# EAGLE design Test 1 (EAGLE 7.2.0)
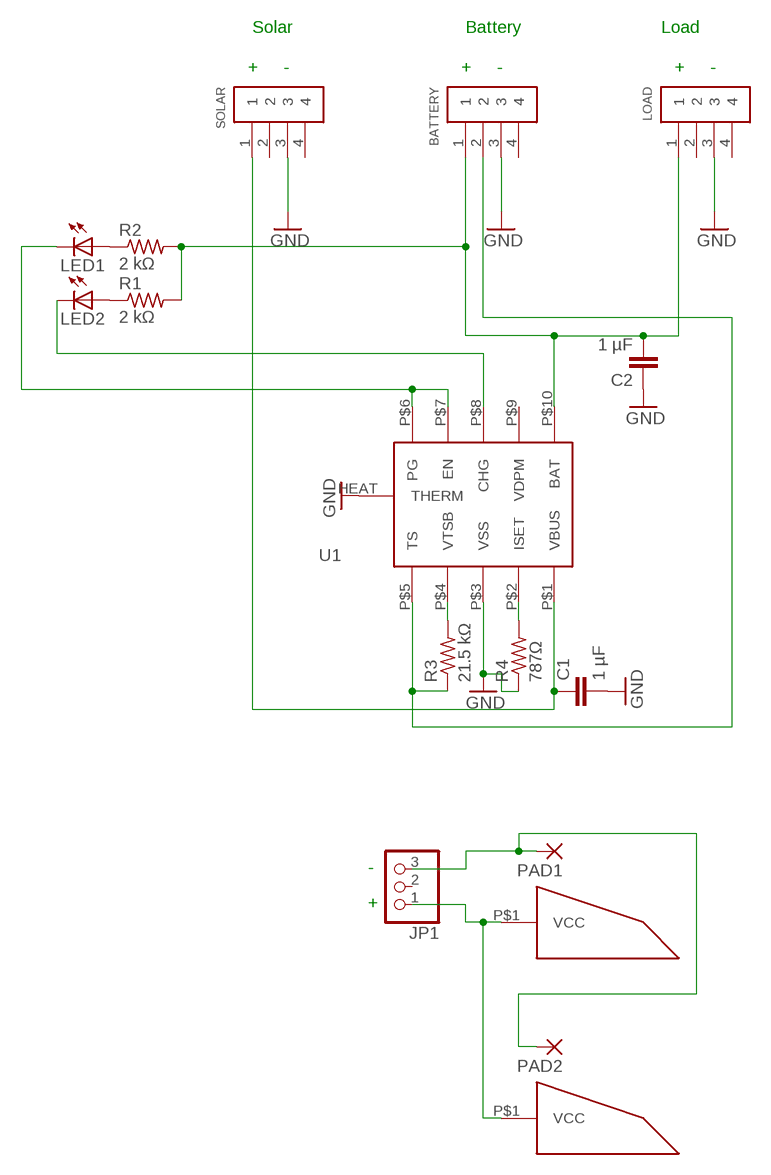
[diagram p0: schematic, sheet 1]

## Parts
BATTERY  1X4-CLEANBIG  [1X04-CLEANBIG]
C1  1 µF  C-EUC0805  [C0805]
C2  1 µF  C-EUC0805  [C0805]
JP1  PINHD-1X3  [1X03]
LED1  LEDCHIP-LED0805  [CHIP-LED0805]
LED2  LEDCHIP-LED0805  [CHIP-LED0805]
LOAD  1X4-CLEANBIG  [1X04-CLEANBIG]
PAD1  SMD2  [SMD1,27-2,54]
PAD2  SMD2  [SMD1,27-2,54]
R1  2 kΩ  R-US_R0805  [R0805]
R2  2 kΩ  R-US_R0805  [R0805]
R3  21.5 kΩ  R-US_R0805  [R0805]
R4  787Ω  R-US_R0805  [R0805]
SOLAR  1X4-CLEANBIG  [1X04-CLEANBIG]
U1  BQ24210  [BQ24210]
U$1  TRISOLX  [TRISOLX]
U$2  TRISOLX  [TRISOLX]

## Nets
GND: BATTERY.3 C1.2 C2.1 LOAD.3 R4.1 SOLAR.3 U1.HEAT(THERM) U1.P$3(VSS)
N$1: LED1.C U1.P$6(PG) U1.P$7(EN)
N$2: BATTERY.2 R3.1 U1.P$5(TS)
N$3: BATTERY.1 C2.2 LOAD.1 R1.2 R2.2 U1.P$10(BAT)
N$4: C1.1 SOLAR.1 U1.P$1(VBUS)
N$5: LED1.A R2.1
N$6: LED2.A R1.1
N$7: R3.2 U1.P$4(VTSB)
N$8: R4.2 U1.P$2(ISET)
N$9: LED2.C U1.P$8(CHG)
N$10: JP1.3 PAD1.1(P) PAD2.1(P)
N$11: JP1.1 U$1.P$1(VCC) U$2.P$1(VCC)
Unconnected: BATTERY.4 JP1.2 LOAD.2 LOAD.4 SOLAR.2 SOLAR.4 U1.P$9(VDPM)

## Notes on the sheet
- Solar | Battery | Load
- + | - | + | - | + | -
- -
- +

## Library data of the parts
BATTERY LOAD SOLAR = adafruit:1X4: 4-pin connector
C1 C2 = rcl:C-EU: CAPACITOR, European symbol
JP1 = adafruit:PINHD-1X3: PIN HEADER
LED1 LED2 = adafruit:LED: LED OSRAM: - CHIPLED LG R971, LG N971, LY N971, LG Q971, LY Q971, LO R971, LY R971 LH N974, LH R974 LS Q976, LO Q976, LY Q976 LO Q996 - Hyper CHIPLED LW Q18S LB Q993, LB Q99A, LB R99A - SideLED LS A670, LO A670, LY A670, LG A670, LP A670 LB A673, LV A673, LT A673, LW A673 LH A674 LY A675 LS A676, LA A676, LO A676, LY A676, LW A676 LS A679, LY A679, LG A679 - Hyper Micro SIDELED® LS Y876, LA Y876, LO Y876, LY Y876 LT Y87S - SmartLED LW L88C, LW L88S LB L89C, LB L89S, LG L890 LS L89K, LO L89K, LY L89K LS L896, LA L896, LO L896, LY L896 - TOPLED LS T670, LO T670, LY T670, LG T670, LP T670 LSG T670, LSP T670, LSY T670, LOP T670, LYG T670 LG T671, LOG T671, LSG T671 LB T673, LV T673, LT T673, LW T673 LH T674 LS T676, LA T676, LO T676, LY T676, LB T676, LH T676, LSB T676, LW T676 LB T67C, LV T67C, LT T67C, LS T67K, LO T67K, LY T67K, LW E67C LS E67B, LA E67B, LO E67B, LY E67B, LB E67C, LV E67C, LT E67C LW T67C LS T679, LY T679, LG T679 LS T770, LO T770, LY T770, LG T770, LP T770 LB T773, LV T773, LT T773, LW T773 LH T774 LS E675, LA E675, LY E675, LS T675 LS T776, LA T776, LO T776, LY T776, LB T776 LHGB T686 LT T68C, LB T68C - Hyper Mini TOPLED® LB M676 - Mini TOPLED Santana® LG M470 LS M47K, LO M47K, LY M47K Source: http://www.osram.convergy.de/
PAD1 PAD2 = wirepad:SMD2: SMD PAD
R1-R4 = adafruit:R-US_: RESISTOR, American symbol
U1 = satellite:BQ24210: Texas Instruments Solar Li-Ion Battery Charger Input Voltage: 3.5V - 18V Output Voltage: 4.2V @ 800mAh
U$1 U$2 = trisolx:TRISOLX

## Board
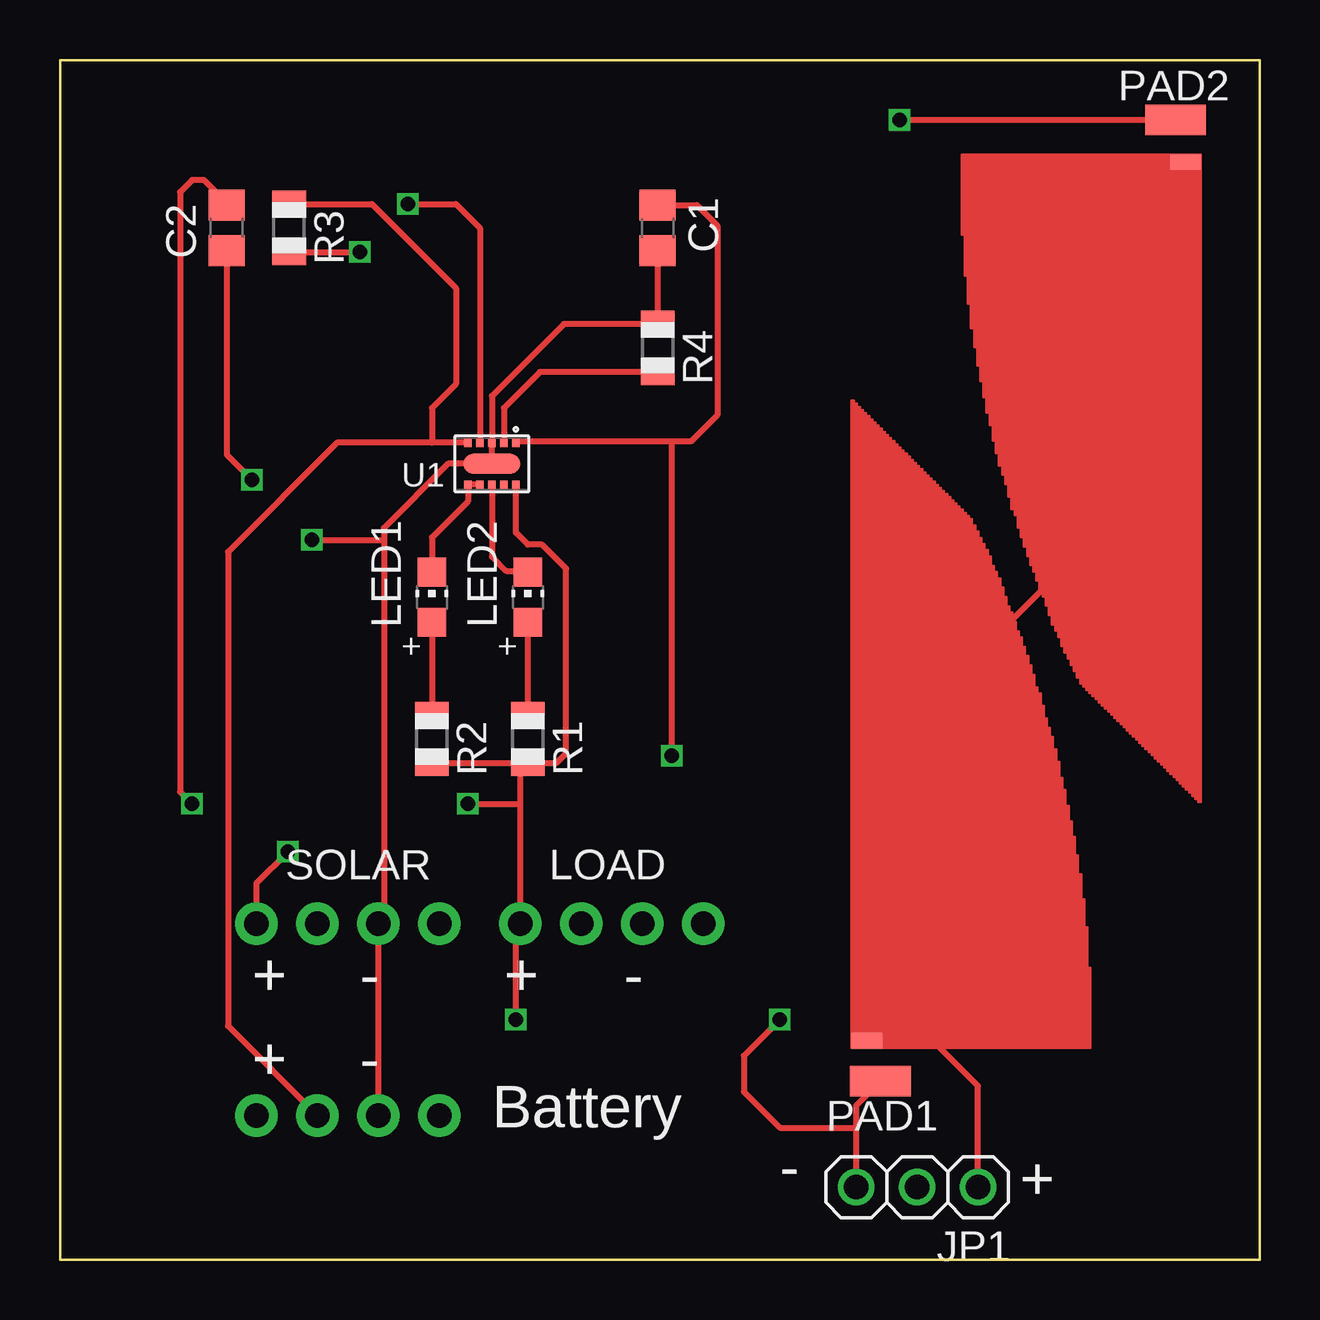
[diagram p1: board, top side]
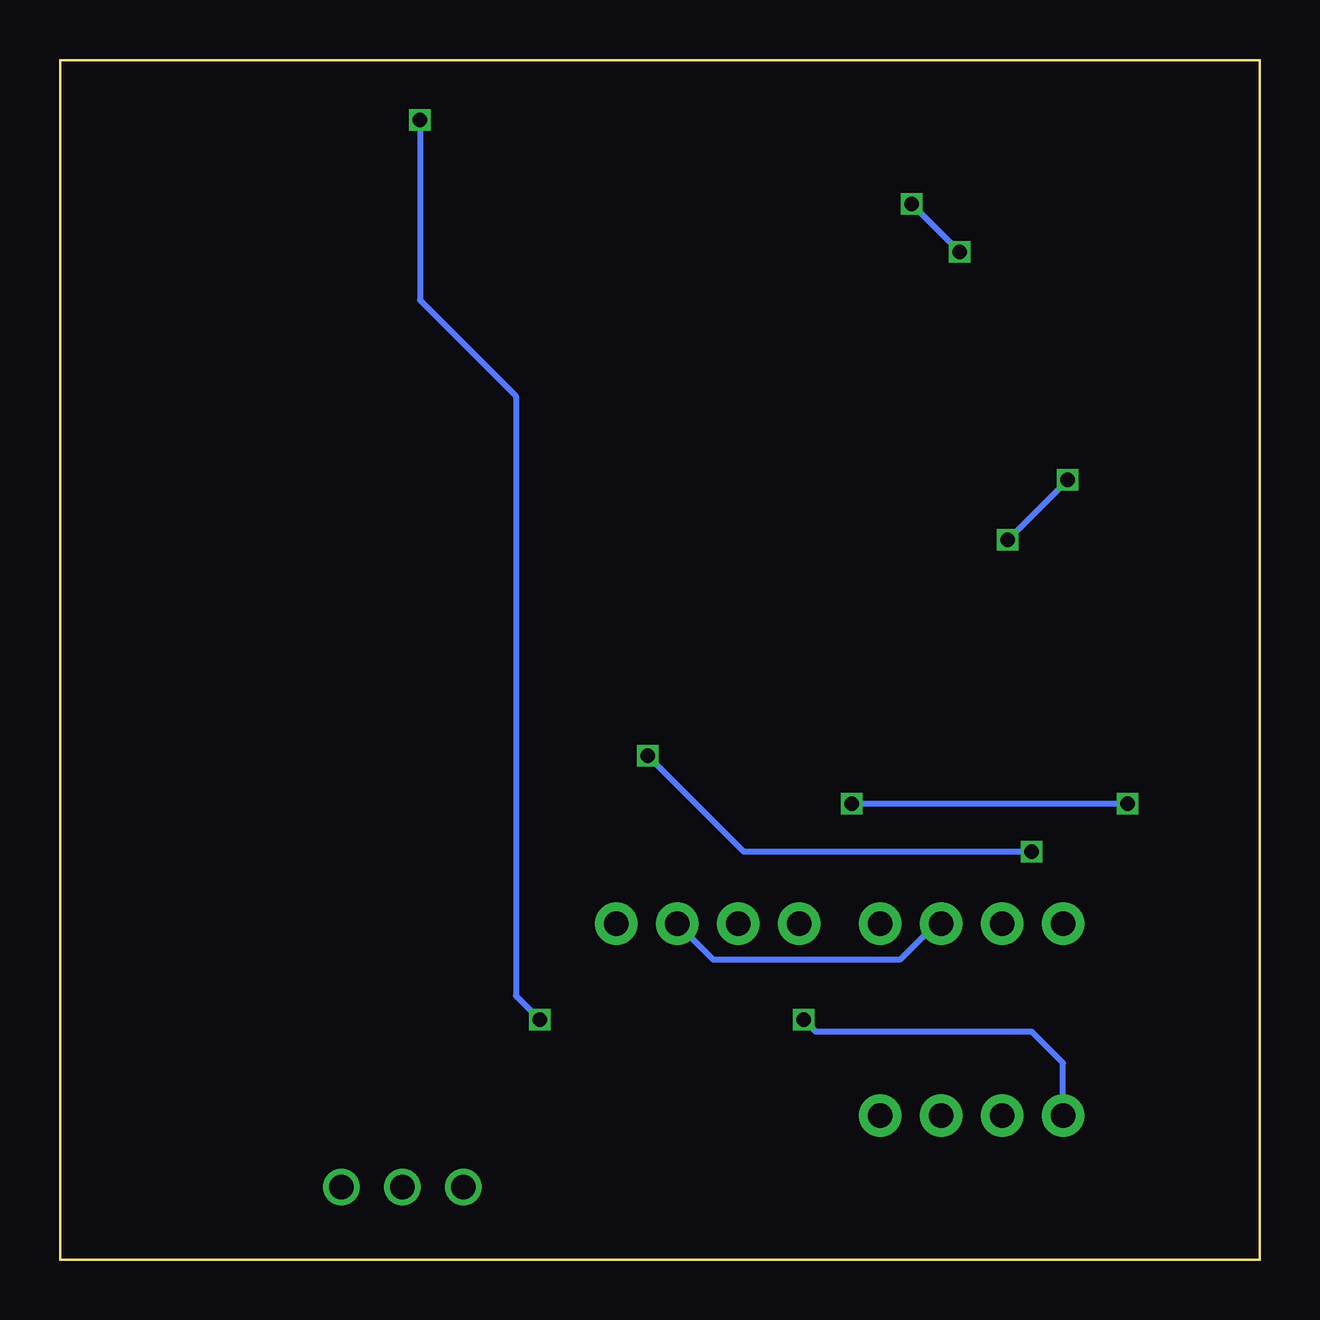
[diagram p2: board, bottom side, seen from below]

Size 50 x 50 mm. Coordinates in mm from the lower left corner, seen from the top.
Outline: 0,0 0,50 50,50 50,0 0,0
Copper layers (1*16): Top 0.035mm / dielectric 1.5mm / Bottom 0.035mm
Design rules "SeeedStudio_2layer_DRU_no_angle_20140221": minimum track width 6mil, minimum drill 12mil, track to track 6mil, track to pad 6mil, pad to pad 6mil, via to via 6mil, smd to smd 0mil, copper to edge 10mil, drill to drill 10mil, minimum pad ring 10mil, minimum via ring 6mil, stop-mask expansion 2mil, vias tented up to drill 100mil, thermal gap 10mil

### Footprints (pad centres in the part's own frame; a part is rotated, then mirrored left to right if it is on the bottom)
1X04-CLEANBIG = drill 1.016 pad 1.778: 1 -3.81,0; 2 -1.27,0; 3 1.27,0; 4 3.81,0
C0805 = smd 1.3 x 1.5: 1 -0.95,0; 2 0.95,0
1X03 = drill 1.016: 1 -2.54,0; 2 0,0; 3 2.54,0
CHIP-LED0805 = smd 1.2 x 1.2: A 0,-1.05; C 0,1.05
SMD1,27-2,54 = smd 1.27 x 2.54: 1 0,0
R0805 = smd 1.1 x 1.4: 1 -1,0; 2 1,0
BQ24210 = smd 2.4 x 0.84: HEAT 1.15,-1.05 | smd 0.3 x 0.35: P$1 0.15,-1.925; P$2 0.65,-1.925; P$3 1.15,-1.925; P$4 1.65,-1.925; P$5 2.15,-1.925; P$6 2.15,-0.175; P$7 1.65,-0.175; P$8 1.15,-0.175; P$9 0.65,-0.175; P$10 0.15,-0.175
TRISOLX = smd 1.27 x 0.635: P$1 0.584,0.26

### Placement (x,y rotation side)
BATTERY  12,6 0 top
C1  24.91,43 270 top
C2  6.95,43 90 top
JP1  35.73,3.02 180 top
LED1  15.5,27.61 0 top
LED2  19.5,27.61 0 top
LOAD  23,14 0 top
PAD1  34.2,7.43 90 top
PAD2  46.5,47.5 270 top
R1  19.5,21.7 270 top
R2  15.5,21.7 270 top
R3  9.55,43 270 top
R4  24.91,38 270 top
SOLAR  12,14 0 top
U1  19.15,32.12 180 top
U$1  33.04,8.87 0 top
U$2  47.5,46 180 top

### Tracks (layer width: path | path; a pad name or v marks a point on that pad's centre or on a via)
GND  (via drill 0.6)
  Top 0.254: C1.2 R4.1 21,39 18,36 U1.P$3 U1.HEAT 16.17,33.17 13.5,30.5 13.5,30 | BATTERY.3 SOLAR.3 13.5,14.23 13.5,30 | C2.1 6.95,33.55 v8,32.5 | v10.5,30 13.5,30
  Bottom 0.254: SOLAR.3 13.5,14 15,12.5 22.77,12.5 LOAD.3 | v8,32.5 v10.5,30
N$1
  Top 0.254: U1.P$7 U1.P$6 17,31.6 15.5,30.1 LED1.C
N$2
  Top 0.254: U1.P$5 15.5,34.05 | 15.5,34.05 11.54,34.05 7,29.5 7,9.73 BATTERY.2 | R3.1 13,44 16.5,40.5 16.5,36.5 15.5,35.5 15.5,34.05
N$3  (via drill 0.6)
  Top 0.254: R2.2 R1.2 | R1.2 20.7,20.7 21.1,21.1 21.1,28.8 20.1,29.8 19.5,29.8 19,30.3 U1.P$10 | C2.2 6.95,44.05 6,45 5.5,45 5,44.5 5,19.5 v5.5,19 | v19,10 19,13.81 LOAD.1 19.19,19 | 19.19,19 19.19,20.39 R1.2 | v17,19 19.19,19
  Bottom 0.254: BATTERY.1 8.19,8.19 9.5,9.5 18.5,9.5 v19,10 | v5.5,19 v17,19
N$4  (via drill 0.6)
  Top 0.254: C1.1 26.55,43.95 27.4,43.1 27.4,35.2 26.3,34.1 25.5,34.1 | 25.5,34.1 19.05,34.1 U1.P$1 | SOLAR.1 8.19,15.69 v9.5,17 | v25.5,21 25.5,34.1
  Bottom 0.254: v9.5,17 21.5,17 v25.5,21
N$5
  Top 0.254: LED1.A R2.1
N$6
  Top 0.254: R1.1 LED2.A
N$7  (via drill 0.6)
  Top 0.254: R3.2 v12.5,42 | v14.5,44 16.5,44 17.5,43 U1.P$4
  Bottom 0.254: v12.5,42 v14.5,44
N$8
  Top 0.254: R4.2 20,37 18.5,35.5 U1.P$2
N$9
  Top 0.254: U1.P$8 18,29.3 18.6,28.7 19.46,28.7 LED2.C
N$10  (via drill 0.6)
  Top 0.254: JP1.3 33.19,5.5 | 33.19,5.5 33.19,6.42 PAD1.1 | PAD2.1 v35,47.5 | v30,10 28.5,8.5 28.5,7 30,5.5 33.19,5.5
  Bottom 0.254: v35,47.5 35,40 31,36 31,11 v30,10
N$11
  Top 0.254: JP1.1 38.27,7.23 36.5,9 34,9 33.5,9.5 33.5,9.25 U$1.P$1 34,9.51 34,10 35,11 35,22 46.92,33.92 U$2.P$1

### Text on the board
tPlace: + | - | + | - | + | - | Battery | - | +